# Altium schematic sheet Microcontroller.SchDoc: Microcontroller
size B; CheckedBy: Logan Hartford; Engineer: Josh Harper; Organization: UW Robotics; Address1: 200 University Avenue; Address2: Waterloo; Address3: Ontario; Address4: Canada N2L 3G6; DocumentNumber: 7; Revision: 3; SheetNumber: 1; SheetTotal: 6
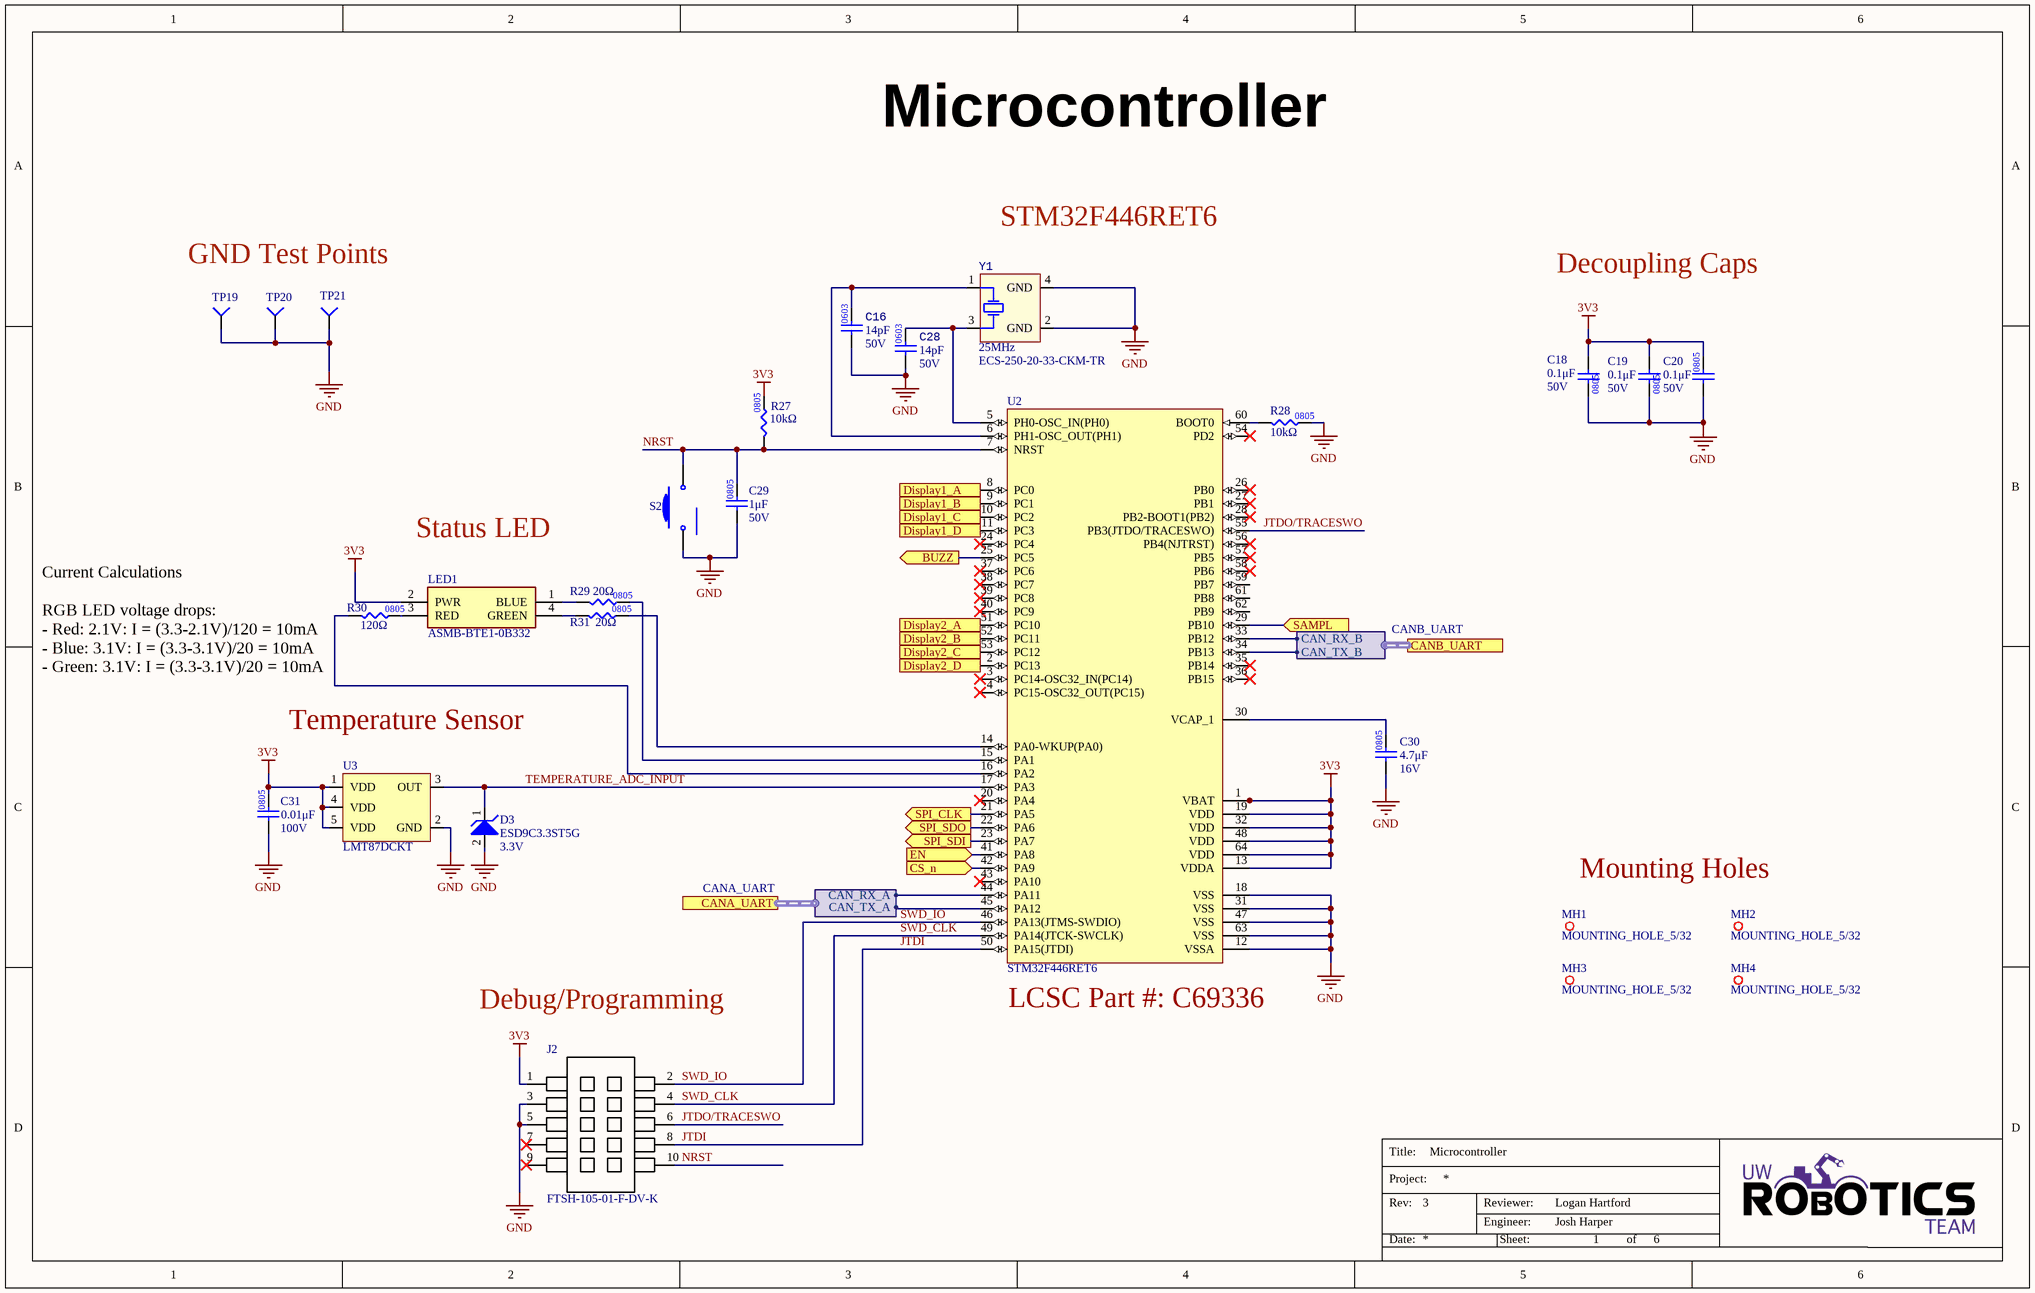
[diagram p0: Microcontroller.SchDoc]

## Parts
C16  value 14pF  Voltage Rating: 50V  [CAP0603]  (hidden comment: CAP_14pF_50V_0603)
C18  value 0.1μF  Voltage Rating: 50V  [CAP2012]  (hidden comment: CAP_0.1uF_50V_0805)
C19  value 0.1μF  Voltage Rating: 50V  [CAP2012]  (hidden comment: CAP_0.1uF_50V_0805)
C20  value 0.1μF  Voltage Rating: 50V  [CAP2012]  (hidden comment: CAP_0.1uF_50V_0805)
C28  value 14pF  Voltage Rating: 50V  [CAP0603]  (hidden comment: CAP_14pF_50V_0603)
C29  value 1μF  Voltage Rating: 50V  [CAP2012]  (hidden comment: CAP_1uF_50V_0805)
C30  value 4.7μF  Voltage Rating: 16V  [CAP0805]  (hidden comment: CAP_4.7uF_16V_0805)
C31  value 0.01μF  Voltage Rating: 100V  [CAP0805]  (hidden comment: CAP_0.01uF_100V_0805)
D3  ESD9C3.3ST5G  Voltage: 3.3V  [ESD9C3.3ST5G]
J2  Manufacturer Part Number 1: FTSH-105-01-F-DV-K  [FTSH-105-01-F-DV-K-P-TR]  (hidden comment: CON_PROGRAMMING)
LED1  ASMB-BTE1-0B332  [ASMBBTE10B332]
MH1  MOUNTING_HOLE_5/32  [MOUNTING_HOLE_5/38]  (no BOM)
MH2  MOUNTING_HOLE_5/32  [MOUNTING_HOLE_5/38]  (no BOM)
MH3  MOUNTING_HOLE_5/32  [MOUNTING_HOLE_5/38]  (no BOM)
MH4  MOUNTING_HOLE_5/32  [MOUNTING_HOLE_5/38]  (no BOM)
R27  value 10kΩ  [RES0805]  (hidden comment: RES_10kΩ_0805_5%)
R28  value 10kΩ  [RES0805]  (hidden comment: RES_10kΩ_0805_5%)
R29  value 20Ω  [RES0805]  (hidden comment: RES_20Ω_0805_1%)
R30  value 120Ω  [RES0805]  (hidden comment: RES_120Ω_0805_1%)
R31  value 20Ω  [RES0805]  (hidden comment: RES_20Ω_0805_1%)
S2  SW_PUSHBUTTON  [TACTILE_SWITCH_SMD]  (value not drawn)
TP19  TESTPOINT_SMD_LOOP  [S1751-46R]  (value not drawn)
TP20  TESTPOINT_SMD_LOOP  [S1751-46R]  (value not drawn)
TP21  TESTPOINT_SMD_LOOP  [S1751-46R]  (value not drawn)
U2  STM32F446RET6  [STM-LQFP64_L]
U3  Manufacturer Part Number 1: LMT87DCKT  [SOT65P210X110-5N]  (hidden comment: IC_TEMP_SENSOR_2)
Y1  Frequency: 25MHz  Manufacturer Part Number 1: ECS-250-20-33-CKM-TR  [XTAL_ECS-250-20-33-CKM-TR]  (hidden comment: CRYSTAL_25MHZ_20PF)

## Ports
BUZZ (out), CANA_UART (harness CANA_UART), CANB_UART (harness CANB_UART), CS_n (in), Display1_A (out), Display1_B (out), Display1_C (out), Display1_D (out), Display2_A (out), Display2_B (out), Display2_C (out), Display2_D (out), EN (in), SAMPL (in), SPI_CLK (out), SPI_SDI (out), SPI_SDO (out)

## Harnesses
CANB_UART: CAN_RX_B, CAN_TX_B
CANA_UART: CAN_RX_A, CAN_TX_A

## Nets
3V3: C18.2 C19.2 C20.2 C31.2 J2.1 LED1.2(PWR) R27.2 U2.1(VBAT) U2.13(VDDA) U2.19(VDD) U2.32(VDD) U2.48(VDD) U2.64(VDD) U3.1(VDD) U3.4(VDD) U3.5(VDD)
GND: C16.1 C18.1 C19.1 C20.1 C28.1 C29.1 C30.1 C31.1 D3.2 J2.3 J2.5 R28.2 S2.1 TP19.1(=value) TP20.1(=value) TP21.1(=value) U2.12(VSSA) U2.18(VSS) U2.31(VSS) U2.47(VSS) U2.63(VSS) U3.2(GND) Y1.2(GND) Y1.4(GND)
BUZZ: U2.25(PC5) ; port BUZZ
CS_n: U2.42(PA9) ; port CS_n
Display1_A: U2.8(PC0) ; port Display1_A
Display1_B: U2.9(PC1) ; port Display1_B
Display1_C: U2.10(PC2) ; port Display1_C
Display1_D: U2.11(PC3) ; port Display1_D
Display2_A: U2.51(PC10) ; port Display2_A
Display2_B: U2.52(PC11) ; port Display2_B
Display2_C: U2.53(PC12) ; port Display2_C
Display2_D: U2.2(PC13) ; port Display2_D
EN: U2.41(PA8) ; port EN
JTDI: J2.8 U2.50(PA15(JTDI))
JTDO/TRACESWO: J2.6 U2.55(PB3(JTDO/TRACESWO))
NRST: C29.2 J2.10 R27.1 S2.2 U2.7(NRST)
SAMPL: U2.29(PB10) ; port SAMPL
SPI_CLK: U2.21(PA5) ; port SPI_CLK
SPI_SDI: U2.23(PA7) ; port SPI_SDI
SPI_SDO: U2.22(PA6) ; port SPI_SDO
SWD_CLK: J2.4 U2.49(PA14(JTCK-SWCLK))
SWD_IO: J2.2 U2.46(PA13(JTMS-SWDIO))
TEMPERATURE_ADC_INPUT: D3.1 U2.17(PA3) U3.3(OUT)
NetC16_2: C16.2 U2.6(PH1-OSC_OUT(PH1)) Y1.1(HOT)
NetC28_2: C28.2 U2.5(PH0-OSC_IN(PH0)) Y1.3(HOT)
NetC30_2: C30.2 U2.30(VCAP_1)
NetLED1_1: LED1.1(BLUE) R29.1
NetLED1_3: LED1.3(RED) R30.2
NetLED1_4: LED1.4(GREEN) R31.1
NetR28_1: R28.1 U2.60(BOOT0)
NetR29_2: R29.2 U2.15(PA1)
NetR30_1: R30.1 U2.16(PA2)
NetR31_2: R31.2 U2.14(PA0-WKUP(PA0))
NetU2_33: U2.33(PB12) ; port CANB_UART.CAN_RX_B
NetU2_34: U2.34(PB13) ; port CANB_UART.CAN_TX_B
NetU2_44: U2.44(PA11) ; port CANA_UART.CAN_RX_A
NetU2_45: U2.45(PA12) ; port CANA_UART.CAN_TX_A

Not connected (* = marked no-connect by the designer): J2 7* 9*; U2 3(PC14-OSC32_IN(PC14))* 4(PC15-OSC32_OUT(PC15))* 20(PA4)* 24(PC4)* 26(PB0)* 27(PB1)* 28(PB2-BOOT1(PB2))* 35(PB14)* 36(PB15)* 37(PC6)* 38(PC7)* 39(PC8)* 40(PC9)* 43(PA10)* 54(PD2)* 56(PB4(NJTRST))* 57(PB5)* 58(PB6)* 59(PB7) 61(PB8) 62(PB9)

## Notes on the sheet
- Microcontroller
- STM32F446RET6
- GND Test Points
- Decoupling Caps
- Status LED
- (near R30) Current Calculations
  RGB LED voltage drops:
  - Red: 2.1V: I = (3.3-2.1V)/120 = 10mA
  - Blue: 3.1V: I = (3.3-3.1V)/20 = 10mA
  - Green: 3.1V: I = (3.3-3.1V)/20 = 10mA
- Temperature Sensor
- Mounting Holes
- Debug/Programming
- (near U2) LCSC Part #: C69336
- Title:
- Project:
- Date:
- Rev:
- Reviewer:
- Engineer:
- Sheet:
- of

## Library data of the parts
C16 C28 = CAP_14pF_50V_0603: CAP CER 14PF 50V C0G/NP0 0603; Manufacturer 1: Samsung; Manufacturer Part Number 1: CL10C140JB8NNNC; Dielectric: C0G; Supplier 1: Digi-Key; Supplier Part Number 1: 1276-2187-1-ND; Mounting Type: SMD; Package: 0603
C18-C20 = CAP_0.1uF_50V_0805: CAP CER 0.1UF 50V X7R 0805; Manufacturer Part Number 1: GCM21BR71H104KA37K; Manufacturer 1: Murata Electronics; Package/Footprint: 0805; Supplier Part Number 1: 490-8049-1-ND; Supplier 1: Digi-Key; Dielectric: X7R; LCSC Part #: C49678; Mounting Type: SMD
C29 = CAP_1uF_50V_0805: CAP CER 1UF 50V X7R 0805; Manufacturer 1: Samsung Electro-Mechanics; Manufacturer Part Number 1: CL21B105KBFNNNG; Supplier 1: Digi-Key; Supplier Part Number 1: 1276-6470-1-ND; LCSC Part #: C28323; Mounting Type: SMD; Package: 0805
C30 = CAP_4.7uF_16V_0805: CAP CER 4.7UF 16V X5R 0805; Manufacturer Part Number 1: CL21A475KOFNNNE; Manufacturer 1: Samsung Electro-Mechanics; Supplier Part Number 1: 1276-1065-1-ND; Supplier 1: Digi-Key; Dielectric: X5R; LCSC Part #: C1779; Mounting Type: SMD; Package: 0805
C31 = CAP_0.01uF_100V_0805: CAP CER 0.01uF 100V X7R 0805; Manufacturer Part Number 1: 08051C103KAT2A; Manufacturer 1: AVX Corporation; Supplier Part Number 1: 478-1358-1-ND; Supplier 1: Digi-Key; Dielectric: X7R; LCSC Part #: C1710; Mounting Type: SMD; Package: 0805
D3 = ESD9C3.3ST5G: TVS DIODE 3.3VWM SOD923; Manufacturer Part Number 1: ESD9C3.3ST5G
J2 = CON_PROGRAMMING: CONN HEADER SMD 10POS 1.27MM; Manufacturer 1: Samtec; Supplier 1: Digi-Key; Pitch: 1.27mm; Supplier Part Number 1: SAM8796-ND; Mounting Type: SMD
LED1 = ASMB-BTE1-0B332: LED RGB DIFFUSED 4PLCC SMD; Manufacturer_Name: Avago Technologies; Datasheet Link: https://docs.broadcom.com/doc/AV02-4236EN; Height: 2.1mm; Mouser Part Number: 630-ASMB-BTE1-0B332; Mouser Price/Stock: https://www.mouser.co.uk/ProductDetail/Broadcom-Avago/ASMB-BTE1-0B332?qs=ToP8pWlZ0bOzYR3dfJnh3g%3D%3D; Manufacturer Part Number 1: ASMB-BTE1-0B332
R27 R28 = RES_10kΩ_0805_5%: RES 10K OHM 5% 1/8W 0805; Manufacturer 1: Panasonic Electronic Components; Manufacturer Part Number 1: ERJ-6GEYJ103V; Package/Footprint: 0805; Supplier Part Number 1: P10KACT-ND; Supplier 1: Digi-Key; LCSC Part #: C17414; Mounting Type: SMD
R29 R31 = RES_20Ω_0805_1%: RES 20 OHM 1% 1/8W 0805; Manufacturer 1: Yageo; Manufacturer Part Number 1: RC0805FR-0720RL; Supplier Part Number 1: 311-20.0CRCT-ND; Supplier 1: Digi-Key; LCSC Part #: C17581; Mounting Type: SMD; Package: 0805
R30 = RES_120Ω_0805_1%: RES 120 OHM 1% 1/8W 0805; Manufacturer 1: Vishay; Manufacturer Part Number 1: CRCW0805120RFKEA; Package/Footprint: 0805; Supplier Part Number 1: 541-120CCT-ND; Supplier 1: Digi-Key; LCSC Part #: C17437; Mounting Type: SMD
S2 = SW_PUSHBUTTON: SMT 3.0 X 2.6 MM TACT SWITCH WIT; Manufacturer Part Number 1: 435151014824; Manufacturer 1: Würth Elektronik; Supplier 1: Digi-Key; Supplier Part Number 1: 732-435151014824CT-ND
TP19-TP21 = TESTPOINT_SMD_LOOP: TESTPOINT SMD LOOP; Manufacturer 1: Harwin; Supplier 1: Digi-Key; Manufacturer Part Number 1: S1751-46R; Mounting Type: SMD; Package/Footprint: SMD; Supplier Part Number 1: 952-1478-1-ND
U2 = MCU_STM32F446RET6: ARM Cortex-M4 32-bit MCU+FPU, 512 KB Flash, 128 KB Internal RAM, 50 I/Os, 64-Pin LQFP, -40 to 85 degC, Tray; I/Os (High Current): 50; Supply Voltage(Vcc) min (V): 1.7; Operating Frequency(F) (Processor speed) (MHz): 180; D/A Converter: 2; Internal RAM Size (kB): 128; FLASH Size (Prog) (kB): 512; Core: ARM Cortex-M4; ComponentLink1Description: Manufacturer URL; Package Reference: 64-Pin Low-profile Quad Flat Package, Body 10 x 10 mm, Pitch 0.5 mm; ComponentLink2URL: http://www.st.com/st-web-ui/static/active/en/resource/technical/document/datasheet/DM00141306.pdf; Packing: Tray; DatasheetVersion: Rev. 6; ComponentLink1URL: http://www.st.com/; ComponentLink2Description: Datasheet; Package Description: LQFP64; Mounting Technology: Surface Mount; Supplier Part Number 1: 497-15376-ND; Supplier 1: Digi-Key
U3 = IC_TEMP_SENSOR_2: SENSOR ANALOG -50C-150C SC70-5; Manufacturer 1: Texas Instruments; Supplier Part Number 1: 296-35730-1-ND; Supplier 1: Digi-Key; Mounting Type: SMD; Package/Footprint: SC70-5
Y1 = CRYSTAL_25MHZ_20PF: CRYSTAL 25.0000MHZ 20PF SMD; Manufacturer 1: ECS Inc.; Load Capacitance: 20pF; Supplier 1: Digi-Key; Supplier Part Number 1: XC1817CT-ND; Mounting Type: SMD; Package/Footprint: SMD